# EAGLE schematic 002_motordriver_mosfet (EAGLE 9.5.2)
CREATEDDATE: 16/2/2020
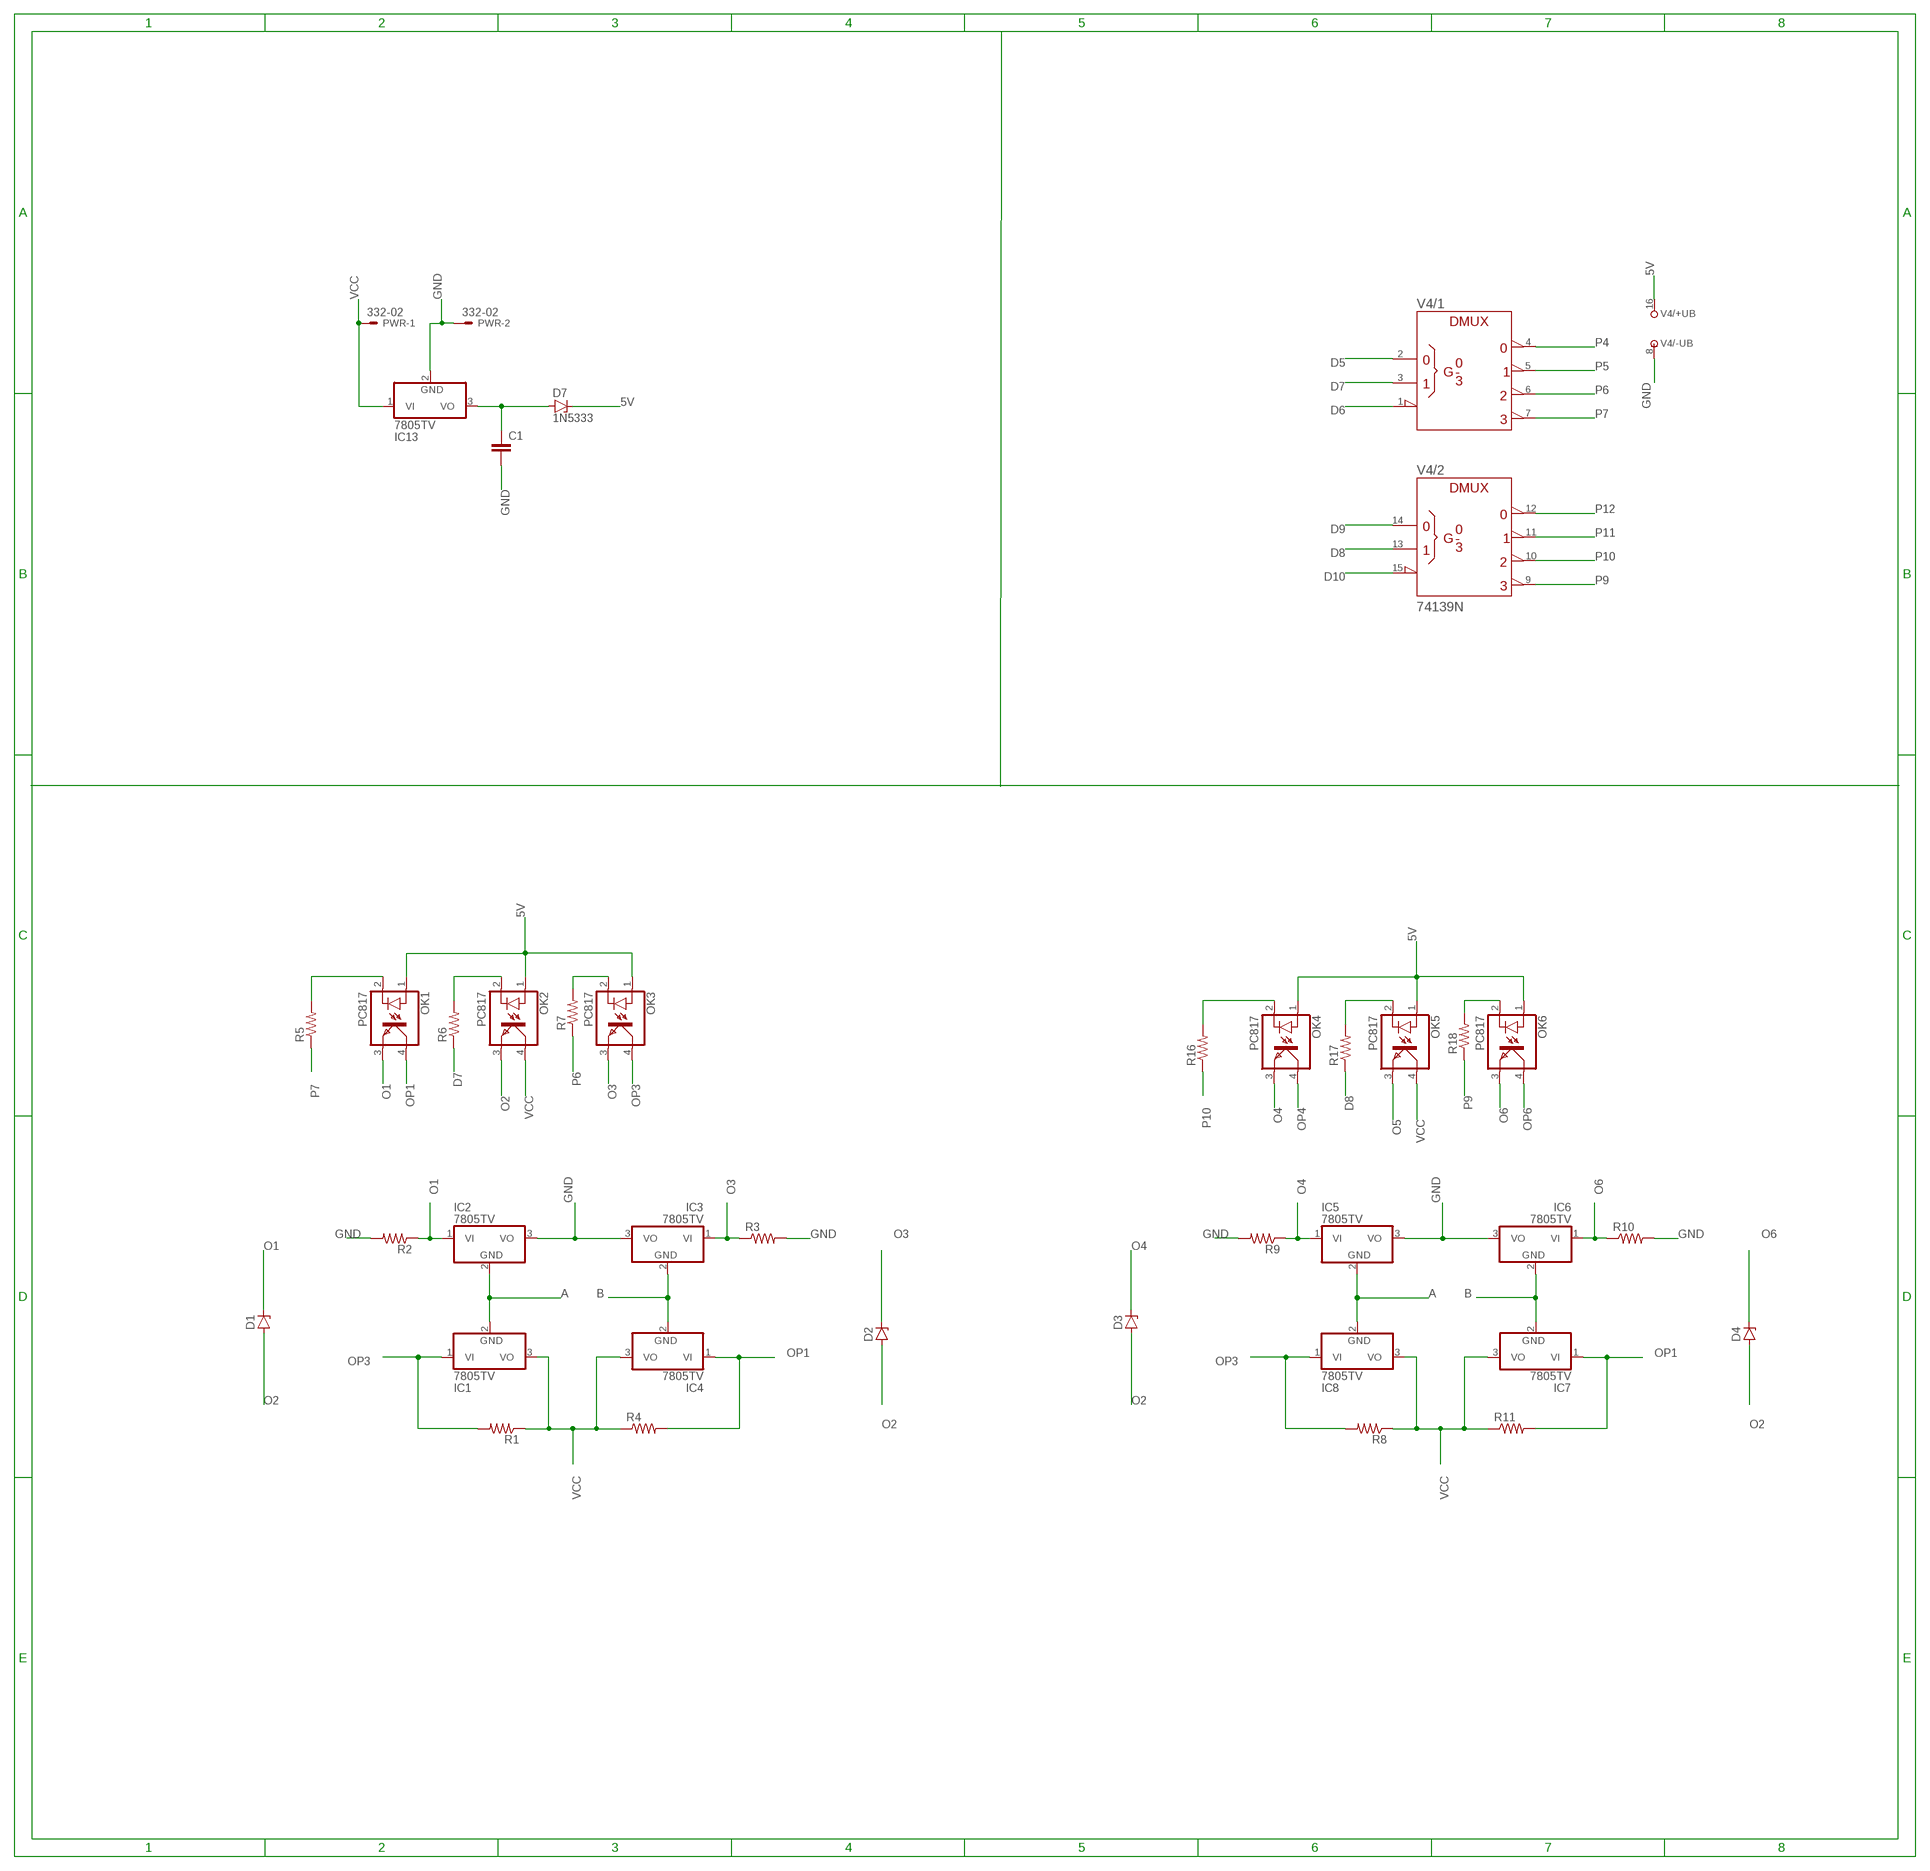
[diagram p0: schematic, sheet 1]

## Parts
C1  C2,5-3  [C2.5-3]
D1  ZENER-DIODEDO41Z10  [DO41Z10]
D2  ZENER-DIODEDO41Z10  [DO41Z10]
D3  ZENER-DIODEDO41Z10  [DO41Z10]
D4  ZENER-DIODEDO41Z10  [DO41Z10]
D7  1N5333  [C1702-15]
IC1  7805TV  [TO220V]
IC2  7805TV  [TO220V]
IC3  7805TV  [TO220V]
IC4  7805TV  [TO220V]
IC5  7805TV  [TO220V]
IC6  7805TV  [TO220V]
IC7  7805TV  [TO220V]
IC8  7805TV  [TO220V]
IC13  7805TV  [TO220V]
OK1  PC817  [DIL04]
OK2  PC817  [DIL04]
OK3  PC817  [DIL04]
OK4  PC817  [DIL04]
OK5  PC817  [DIL04]
OK6  PC817  [DIL04]
PWR  332-02  [332-02]
R1  R-US_M0805  [M0805]
R2  R-US_M0805  [M0805]
R3  R-US_M0805  [M0805]
R4  R-US_M0805  [M0805]
R5  R-US_M0805  [M0805]
R6  R-US_M0805  [M0805]
R7  R-US_M0805  [M0805]
R8  R-US_M0805  [M0805]
R9  R-US_M0805  [M0805]
R10  R-US_M0805  [M0805]
R11  R-US_M0805  [M0805]
R16  R-US_M0805  [M0805]
R17  R-US_M0805  [M0805]
R18  R-US_M0805  [M0805]
V4  74139N  [DIL16]

## Nets
5V: D7.C OK1.1(A) OK2.1(A) OK3.1(A) OK4.1(A) OK5.1(A) OK6.1(A) V4.16(/+UB:+UB)
A: IC1.2(GND) IC2.2(GND) IC5.2(GND) IC8.2(GND)
B: IC3.2(GND) IC4.2(GND) IC6.2(GND) IC7.2(GND)
D5: V4.2(/1:A)
D6: V4.1(/1:!G)
D7: R6.1 V4.3(/1:B)
D8: R17.1 V4.13(/2:B)
D9: V4.14(/2:A)
D10: V4.15(/2:!G)
GND: C1.2 IC2.3(VO) IC3.3(VO) IC5.3(VO) IC6.3(VO) IC13.2(GND) PWR.2 R2.2 R3.2 R9.2 R10.2 V4.8(/-UB:-UB)
N$2: OK4.2(C) R16.2
N$4: OK5.2(C) R17.2
N$5: OK6.2(C) R18.2
N$8: C1.1 D7.A IC13.3(VO)
N$9: OK1.2(C) R5.2
N$10: OK2.2(C) R6.2
N$11: OK3.2(C) R7.2
O1: D1.C IC2.1(VI) OK1.3(EMIT) R2.1
O2: D1.A D2.A D3.A D4.A OK2.3(EMIT)
O3: D2.C IC3.1(VI) OK3.3(EMIT) R3.1
O4: D3.C IC5.1(VI) OK4.3(EMIT) R9.1
O5: OK5.3(EMIT)
O6: D4.C IC6.1(VI) OK6.3(EMIT) R10.1
OP1: IC4.1(VI) IC7.1(VI) OK1.4(COL) R4.2 R11.2
OP3: IC1.1(VI) IC8.1(VI) OK3.4(COL) R1.2 R8.2
OP4: OK4.4(COL)
OP6: OK6.4(COL)
P4: V4.4(/1:Y0)
P5: V4.5(/1:Y1)
P6: R7.1 V4.6(/1:Y2)
P7: R5.1 V4.7(/1:Y3)
P9: R18.1 V4.9(/2:Y3)
P10: R16.1 V4.10(/2:Y2)
P11: V4.11(/2:Y1)
P12: V4.12(/2:Y0)
VCC: IC1.3(VO) IC4.3(VO) IC7.3(VO) IC8.3(VO) IC13.1(VI) OK2.4(COL) OK5.4(COL) PWR.1 R1.1 R4.1 R8.1 R11.1

## Library data of the parts
C1 = capacitor-wima:C: CAPACITOR naming: grid - package width
D1-D4 = diode:ZENER-DIODE: Z-Diode
D7 = diode:1N5333: Z DIODE 3.3 V, 5W, 5 percent (Motorola)
IC1-IC8 IC13 = linear:78*: Positive VOLTAGE REGULATOR Source: http://cache.national.com/ds/LM/LM78L05.pdf http://www.fairchildsemi.com/ds/LM/LM7805.pdf
OK1-OK6 = optocoupler:PC817: SHARP OPTO COUPLER; MPN: PC817X4J000F; OC_FARNELL: 9707727; OC_NEWARK: 97K7059
PWR = con-garry:332-02: 2 Pin - 2mm Dual Row Source: www.mpe-connector.de / garry_shortform_2012.pdf
R1-R11 R16-R18 = rcl:R-US_: RESISTOR, American symbol; SPICEPREFIX: R
V4 = 74ttl-din:74*139: Dual 2-line to 4-line DECODER/DEMULTIPLEXER